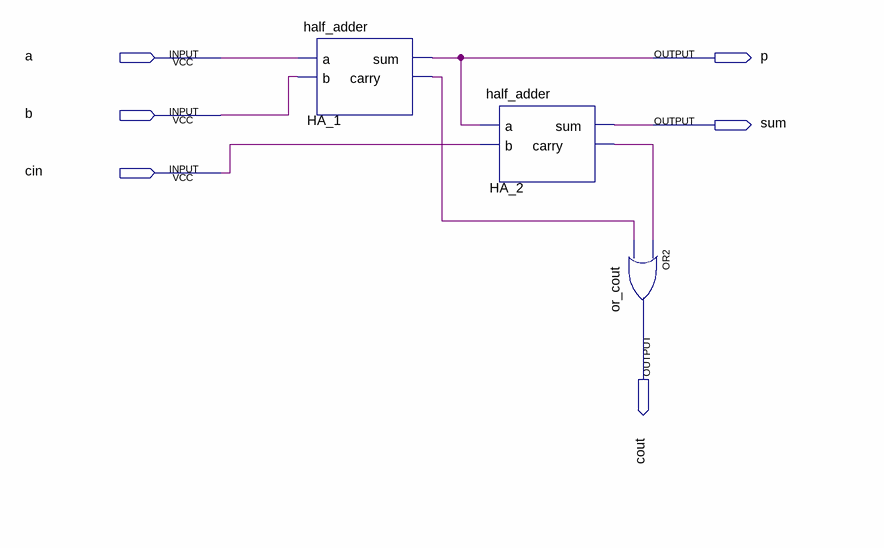
[diagram p0: schematic sheet]
// Quartus schematic full_adder.bdf as structural Verilog: 3 symbols, 6 pins
module full_adder (
  input  a,
  input  b,
  input  cin,
  output p,
  output sum,
  output cout
);

  wire HA_1_carry, HA_2_carry;

  half_adder HA_1 (.a(a), .b(b), .sum(p), .carry(HA_1_carry));
  half_adder HA_2 (.a(p), .b(cin), .sum(sum), .carry(HA_2_carry));
  or or_cout (cout, HA_2_carry, HA_1_carry);
endmodule
